# Altium schematic sheet DualColorLEDLighting-PCB.SchDoc
size A3; SheetNumber: 1; SheetTotal: 1
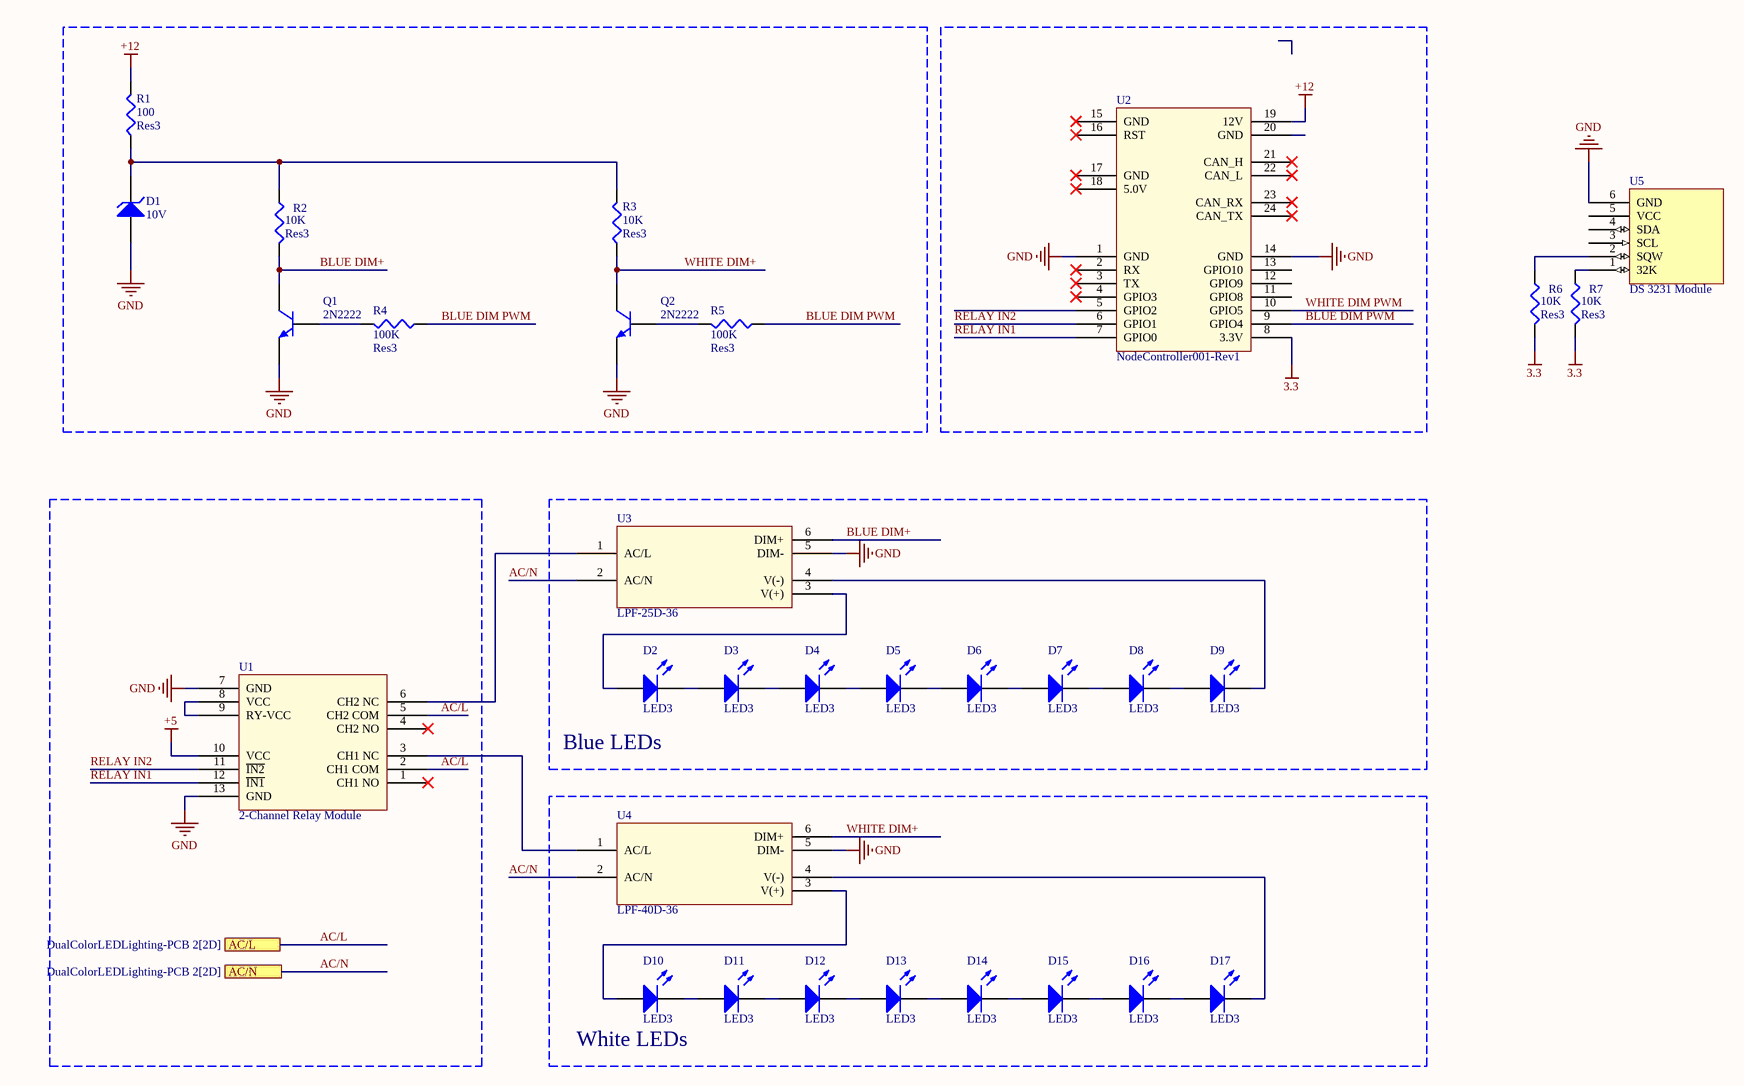
[diagram p0: DualColorLEDLighting-PCB.SchDoc]

## Parts
D1  10V  [DIODE-0.7]
D2  LED3  [3.5X2.8X1.9]
D3  LED3  [3.5X2.8X1.9]
D4  LED3  [3.5X2.8X1.9]
D5  LED3  [3.5X2.8X1.9]
D6  LED3  [3.5X2.8X1.9]
D7  LED3  [3.5X2.8X1.9]
D8  LED3  [3.5X2.8X1.9]
D9  LED3  [3.5X2.8X1.9]
D10  LED3  [3.5X2.8X1.9]
D11  LED3  [3.5X2.8X1.9]
D12  LED3  [3.5X2.8X1.9]
D13  LED3  [3.5X2.8X1.9]
D14  LED3  [3.5X2.8X1.9]
D15  LED3  [3.5X2.8X1.9]
D16  LED3  [3.5X2.8X1.9]
D17  LED3  [3.5X2.8X1.9]
Q1  2N2222  [TO-226-AA]
Q2  2N2222  [TO-226-AA]
R1  Res3  value 100  [J1-0603]
R2  Res3  value 10K  [J1-0603]
R3  Res3  value 10K  [J1-0603]
R4  Res3  value 100K  [J1-0603]
R5  Res3  value 100K  [J1-0603]
R6  Res3  value 10K  [J1-0603]
R7  Res3  value 10K  [J1-0603]
U1  2-Channel Relay Module
U2  NodeController001-Rev1
U3  LPF-25D-36
U4  LPF-40D-36
U5  DS 3231 Module  [RAD0.1B]

## Blocks framed on the sheet
Blue LEDs: D2-D9 U3
White LEDs: D10-D17 U4

## Ports
AC/L (see DualColorLEDLighting-PCB 2[2D]), AC/N (see DualColorLEDLighting-PCB 2[2D])

## Nets
3.3: R6.2 R7.2 U2.8(3.3V)
+5: U1.10(VCC)
+12: R1.2 U2.19(12V)
GND: D1.1(A) Q1.3(E) Q2.3(E) U1.7(GND) U1.13(GND) U2.1(GND) U2.14(GND) U3.5(DIM-) U4.5(DIM-) U5.6(GND)
AC/L: U1.2(CH1_COM) U1.5(CH2_COM) ; port AC/L
AC/N: U3.2(AC/N) U4.2(AC/N) ; port AC/N
BLUE DIM PWM: R4.1 R5.1 U2.9(GPIO4)
BLUE DIM+: Q1.1(C) R2.2 U3.6(DIM+)
RELAY IN1: U1.12(~{IN1}) U2.7(GPIO0)
RELAY IN2: U1.11(~{IN2}) U2.6(GPIO1)
WHITE DIM PWM: U2.10(GPIO5)
WHITE DIM+: Q2.1(C) R3.1 U4.6(DIM+)
NetD1_2: D1.2(K) R1.1 R2.1 R3.2
NetD2_1: D2.1(A) U3.3(V(+))
NetD2_2: D2.2(K) D3.1(A)
NetD3_2: D3.2(K) D4.1(A)
NetD4_2: D4.2(K) D5.1(A)
NetD5_2: D5.2(K) D6.1(A)
NetD6_2: D6.2(K) D7.1(A)
NetD7_2: D7.2(K) D8.1(A)
NetD8_2: D8.2(K) D9.1(A)
NetD9_2: D9.2(K) U3.4(V(-))
NetD10_1: D10.1(A) U4.3(V(+))
NetD10_2: D10.2(K) D11.1(A)
NetD11_2: D11.2(K) D12.1(A)
NetD12_2: D12.2(K) D13.1(A)
NetD13_2: D13.2(K) D14.1(A)
NetD14_2: D14.2(K) D15.1(A)
NetD15_2: D15.2(K) D16.1(A)
NetD16_2: D16.2(K) D17.1(A)
NetD17_2: D17.2(K) U4.4(V(-))
NetQ1_2: Q1.2(B) R4.2
NetQ2_2: Q2.2(B) R5.2
NetR6_1: R6.1 U5.2(SQW)
NetR7_1: R7.1 U5.1(32K)
NetU1_3: U1.3(CH1_NC) U4.1(AC/L)
NetU1_6: U1.6(CH2_NC) U3.1(AC/L)
NetU1_8: U1.8(VCC) U1.9(RY-VCC)

Not connected (* = marked no-connect by the designer): U1 1(CH1_NO)* 4(CH2_NO)*; U2 2(RX)* 3(TX)* 4(GPIO3)* 5(GPIO2) 11(GPIO8) 12(GPIO9) 13(GPIO10) 15(GND)* 16(RST)* 17(GND)* 18(5.0V)* 20(GND) 21(CAN_H)* 22(CAN_L)* 23(CAN_RX)* 24(CAN_TX)*; U5 3(SCL) 4(SDA) 5(VCC)

## Library data of the parts
D1 = D Zener: Zener Diode; Published: 8-Jun-2000; LatestRevisionDate: 17-Jul-2002; LatestRevisionNote: Re-released for DXP Platform.; PackageReference: DIODE-0.7; Publisher: Altium Limited; PackageDescription: Diode, Thru-Hole; 2 Leads; 0.7 in Pin Spacing
D2-D17 = LED3: Typical BLUE SiC LED; Published: 8-Jun-2000; LatestRevisionDate: 17-Dec-2003; LatestRevisionNote: PCB Footprint replaced.; DatasheetVersion: 16-Apr-2002; PackageVersion: 16-Apr-2002; PackageReference: 3.5X2.8X1.9; Publisher: Altium Limited; PackageDescription: SM LED; 2 C-Bend Leads; Body 3.5 x 2.8 x 1.9 mm, inc leads (LxWxH typ)
Q1 Q2 = NPN: NPN Bipolar Transistor; Published: 8-Jun-2000; LatestRevisionDate: 17-Jul-2002; LatestRevisionNote: Re-released for DXP Platform.; PackageReference: TO-226-AA; Publisher: Altium Limited; PackageDescription: TO, Flat Index; 3 In-Line, Axial Leads; Body Dia. 4.8mm; Leads 0.55 x 0.51 mm (max); Code_JEDEC: TO-226-AA
R1-R7 = Res3: Resistor; Published: 8-Jun-2000; LatestRevisionDate: 29-May-2009; LatestRevisionNote: IPC-7351 Footprint Added.; PackageReference: J1-0603; Publisher: Altium Limited; PackageDescription: Chip Resistor
U1 = 2-Channel Relay Module: 2-Channel Relay Module for Arduino & Raspberry Pi - 5V
U3 = LPF-25D-36: LED DRVR CC AC/DC 19.8-36V 700MA
U4 = LPF-40D-36: LED DRVR CC AC/DC 21.6-36V 1.12A
U5 = DS 3231 Module: DS3231 Real Time Clock Module